# Altium project DCCBooster.PrjPCB
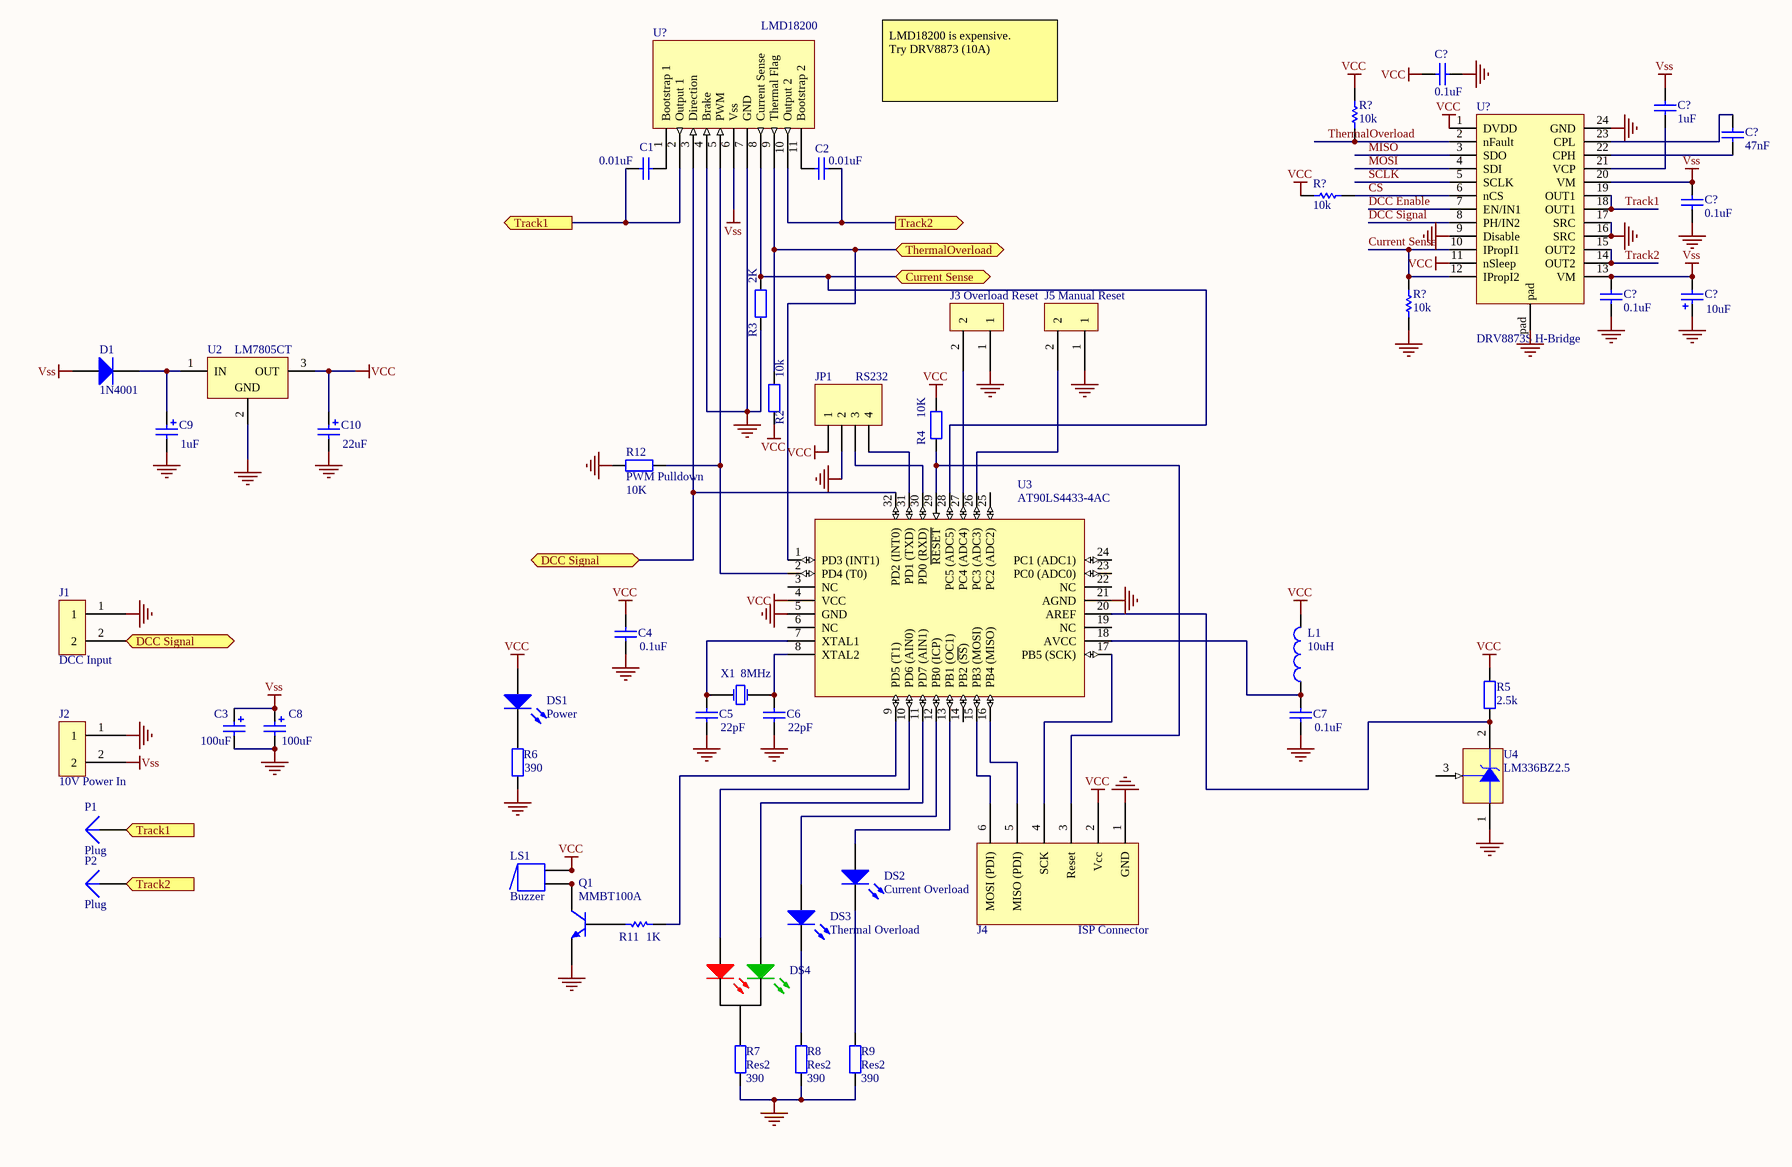
[diagram p0: DCCBooster.SchDoc]
3 sheets, 65 parts. Net scope: flat (ports and power ports of the same name join across sheets).
Board file: DCCBooster.PcbDoc
Sheets:
  DCCBooster.SchDoc
  OptoIsolator.SchDoc
  AckDetect.SchDoc

## Sheet DCCBooster.SchDoc
size A0

### Parts
(Parts that share a designator on the sheet are numbered #1, #2 ... from top to bottom, then left to right.)
*1  LMD18200  [TO220-11V]
C1  value 0.01uF  [RAD-0.1]  (hidden comment: Cap)
C2  value 0.01uF  [RAD-0.1]  (hidden comment: Cap)
C3  value 100uF  [RB5-10.5]  (hidden comment: Cap Pol1)
C4  value 0.1uF  [CC2012-0805]  (hidden comment: Cap)
C5  value 22pF  [CC2012-0805]  (hidden comment: Cap)
C6  value 22pF  [CC2012-0805]  (hidden comment: Cap)
C7  value 0.1uF  [CC2012-0805]  (hidden comment: Cap)
C8  value 100uF  [RB5-10.5]  (hidden comment: Cap Pol1)
C9  value 1uF  [CC2012-0805]  (hidden comment: Cap Pol1)
C10  value 22uF  [CC2012-0805]  (hidden comment: Cap Pol1)
C?#1  value 0.1uF  [Cap SMD 0805A]  (hidden comment: Cap)
C?#2  value 1uF  [Cap SMD 0805A]  (hidden comment: Cap)
C?#3  value 47nF  [Cap SMD 0805A]  (hidden comment: Cap)
C?#4  value 0.1uF  [Cap SMD 0805A]  (hidden comment: Cap)
C?#5  value 0.1uF  [Cap SMD 0805A]  (hidden comment: Cap)
C?#6  value 10uF  [Cap SMD Elect 5x5.3]  (hidden comment: Cap Pol)
D1  1N4001  [DIO10.46-5.3x2.8]
DS1  Power  [LED5mm]
DS2  Current Overload  [LED5mm]
DS3  Thermal Overload  [LED5mm]
DS4  (no value)  [LED5mm TriColour]
J1  DCC Input  [0.1 SIP 2 PIN]
J2  10V Power In  [0.156 SIP 2 PIN]
J3  Overload Reset  [0.1 SIP 2 PIN]
J4  ISP Connector  [0.1 SIP 6 PIN]
J5  Manual Reset  [0.1 SIP 2 PIN]
JP1  RS232  [0.1 SIP 4 PIN]
L1  value 10uH  [RAD-0.1]  (hidden comment: Inductor)
LS1  Buzzer  [Mini PC Mount Piezo]
P1  Plug  [PIN1]
P2  Plug  [PIN1]
Q1  MMBT100A  [318-08]
R2#1  value 10k  [CR2012-0805]  (hidden comment: Res2)
R3  value 2K  [CR2012-0805]  (hidden comment: Res2)
R4  value 10K  [CR2012-0805]  (hidden comment: Res2)
R5  value 2.5k  [CR2012-0805]  (hidden comment: Res2)
R6  value 390  [CR2012-0805]  (hidden comment: Res2)
R7  Res2  value 390  [CR2012-0805]
R8  Res2  value 390  [CR2012-0805]
R9  Res2  value 390  [CR2012-0805]
R11  value 1K  [R2012-0805]  (hidden comment: Res1)
R12  PWM Pulldown  value 10K  [CR2012-0805]
R?#1  value 10k  [Res SMD 0805A]  (hidden comment: Res1)
R?#2  value 10k  [Res SMD 0805A]  (hidden comment: Res1)
R?#3  value 10k  [Res SMD 0805A]  (hidden comment: Res1)
U2  LM7805CT  [T03B]
U3  AT90LS4433-4AC  [32A]
U4  LM336BZ2.5  [Z03A]
U?  DRV8873S H-Bridge  [TSSOP24 PowerPAD]
X1  8MHz  [RAD-0.2]

### Ports
Current Sense (bidir), DCC Signal (bidir), ThermalOverload (bidir), Track1 (out), Track2 (out)

### Nets
GND: *1.4(Brake) *1.7(GND) C3.2 C4.1 C5.1 C6.1 C7.1 C8.2 C9.2 C10.2 C?#1.1 C?#4.1 C?#5.1 C?#6.1 J1.1 J2.1 J3.1 J4.1(GND) J5.1 JP1.2 Q1.2(E) R3.1 R6.1 R7.1 R8.1 R9.1 R12.1 R?#3.1 U2.2(GND) U3.5(GND) U3.21(AGND) U4.1(-V) U?.9(Disable) U?.16(SRC) U?.17(SRC) U?.24(GND) U?.pad
VCC: C4.2 C10.1 C?#1.2 DS1.1(A) J4.2(Vcc) JP1.1 L1.2 LS1.1 LS1.1A R2#1.1 R4.1 R5.2 R?#1.2 R?#2.2 U2.3(OUT) U3.4(VCC) U?.1(DVDD) U?.11(nSleep)
Vss: *1.6(Vss) C3.1 C8.1 C?#2.2 C?#4.2 C?#5.2 C?#6.2 D1.1(A) J2.2 U?.13(VM) U?.20(VM)
CS: R?#2.1 U?.6(nCS)
Current Sense: R?#3.2 U?.10(IPropI1) U?.12(IPropI2)
DCC Enable: U?.7(EN/IN1)
DCC Signal: U?.8(PH/IN2)
MISO: U?.3(SDO)
MOSI: U?.4(SDI)
SCLK: U?.5(SCLK)
ThermalOverload: R?#1.1 U?.2(nFault)
Track1: U?.18(OUT1) U?.19(OUT1)
Track2: U?.14(OUT2) U?.15(OUT2)
Net*1_1: *1.1(Bootstrap_1) C1.1
Net*1_2: *1.2(Output_1) C1.2 P1.1 ; port Track1
Net*1_3: *1.3(Direction) J1.2 U3.32(PD2_(INT0)) ; port DCC Signal
Net*1_5: *1.5(PWM) R12.2 U3.2(PD4_(T0))
Net*1_8: *1.8(Current_Sense) R3.2 U3.28(PC5_(ADC5)) ; port Current Sense
Net*1_9: *1.9(Thermal_Flag) R2#1.2 U3.1(PD3_(INT1)) ; port ThermalOverload
Net*1_10: *1.10(Output_2) C2.1 P2.1 ; port Track2
Net*1_11: *1.11(Bootstrap_2) C2.2
NetC5_2: C5.2 U3.7(XTAL1) X1.1(OSC1)
NetC6_2: C6.2 U3.8(XTAL2) X1.2(OSC2)
NetC7_2: C7.2 L1.1 U3.18(AVCC)
NetC9_1: C9.1 D1.2(K) U2.1(IN)
NetC?#2_1: C?#2.1 U?.21(VCP)
NetC?#3_1: C?#3.1 U?.22(CPH)
NetC?#3_2: C?#3.2 U?.23(CPL)
NetDS1_2: DS1.2(K) R6.2
NetDS2_1: DS2.1(A) U3.13(PB1_(OC1))
NetDS2_2: DS2.2(K) R9.2
NetDS3_1: DS3.1(A) U3.12(PB0_(ICP))
NetDS3_2: DS3.2(K) R8.2
NetDS4_1: DS4.1(Ag) U3.11(PD7_(AIN1))
NetDS4_2: DS4.2(K) R7.2
NetDS4_3: DS4.3(Ar) U3.10(PD6_(AIN0))
NetJ3_2: J3.2 U3.27(PC4_(ADC4))
NetJ4_3: J4.3(Reset) R4.2 U3.29(~{RESET})
NetJ4_4: J4.4(SCK) U3.17(PB5_(SCK))
NetJ4_5: J4.5(MISO_(PDI)) U3.16(PB4_(MISO))
NetJ4_6: J4.6(MOSI_(PDI)) U3.15(PB3_(MOSI))
NetJ5_2: J5.2 U3.26(PC3_(ADC3))
NetJP1_3: JP1.3 U3.30(PD0_(RXD))
NetJP1_4: JP1.4 U3.31(PD1_(TXD))
NetLS1_2: LS1.2 LS1.2A Q1.3(C)
NetQ1_1: Q1.1(B) R11.2
NetR5_1: R5.1 U3.20(AREF) U4.2(+V)
NetR11_1: R11.1 U3.9(PD5_(T1))

Not connected (* = marked no-connect by the designer): U3 3(NC) 6(NC) 14(PB2_(~{SS})) 19(NC) 22(NC) 23(PC0_(ADC0)) 24(PC1_(ADC1)) 25(PC2_(ADC2)); U4 3(ADJ)

### Notes on the sheet
- LMD18200 is expensive.
  Try DRV8873 (10A)

### Library data of the parts
C1 C2 C4-C7 C?#1-C?#5 = Cap: Capacitor; Published: 8-Jun-2000; Publisher: Altium Limited
  C1 C2 C4-C7: Revision: July-2002: Re-released for DXP Platform.
  C?#1-C?#5: LatestRevisionDate: 17-Jul-2002; LatestRevisionNote: Re-released for DXP Platform.; PackageReference: RAD-0.3; PackageDescription: Radial Cap, Thru-Hole; 2 Leads; 0.3 in Pin Spacing
C3 C8-C10 = Cap Pol1: Polarized Capacitor (Radial); Published: 8-Jun-2000; Revision: July-2002: Re-released for DXP Platform.; Publisher: Altium Limited
C?#6 = Cap Pol: Polarized Capacitor (Radial); Published: 8-Jun-2000; LatestRevisionDate: 17-Jul-2002; LatestRevisionNote: Re-released for DXP Platform.; PackageReference: RB7.6-15; Publisher: Altium Limited; PackageDescription: Polarized Capacitor (Radial); 2 Leads
D1 = Diode 1N4001: 1 Amp General Purpose Rectifier; Revision 1: 11-Jul-2000: SIM Model Added.; Revision 2: 17-Jul-2002: Re-released for DXP Platform.; Package Information: Latest Revision: Aug-1999; Code - JEDEC: DO-204-AL; Published: 8-Jun-2000; Datasheet: Latest Revision: 1998; Package Reference: DO-41; Publisher: Altium Limited
DS1-DS3 = LED0: Typical INFRARED GaAs LED; Published: 8-Jun-2000; Revision: July-2002: Re-released for DXP Platform.; Publisher: Altium Limited
DS4 = LED Tricolour: Typical Red Green Tri Color LED; Published: 8-Jun-2000; Revision: July-2002: Re-released for DXP Platform.; Publisher: Altium Limited
J1-J3 J5 = SIP2 CONNECTOR
JP1 = Header 4: Header, 4-Pin; Revision: 17-Jul-2002: Re-released for DXP Platform.; Publisher: Altium Limited
LS1 = Buzzer: Magnetic Transducer Buzzer; Revision 1: Jul-2002: Re-released for DXP Platform.; Revision 2: 17-Dec-2003: Schematic revised, PCB Footprint replaced.; Published: 17-Dec-2003; Datasheet: Latest Revision: 17-Dec-2003; Publisher: Altium Limited
Q1 = MMBT100A: General Purpose Amplifier NPN Silicon; Package Information: Latest Revision: 1997; Published: 29-Sep-2000; Revision: 17-Jul-2002: Re-released for DXP Platform.; Datasheet: Latest Revision: 1996; Package Reference: 318-08; Publisher: Altium Limited
R2#1 R3-R9 R12 = Res2: Resistor; Published: 8-Jun-2000; Revision: July-2002: Re-released for DXP Platform.; Publisher: Altium Limited
R11 = Res1: Resistor; Published: 8-Jun-2000; Revision: July-2002: Re-released for DXP Platform.; Publisher: Altium Limited
R?#1-R?#3 = Resistor
U2 = LM7805CT: Series 3-Terminal Positive Regulator; Package Information: Latest Revision: 1995; Note: Tab is connected to GND; Published: 15-Apr-2002; Datasheet: Latest Revision: May-1999; Package Reference: T03B; Publisher: Altium Limited
U3 = AT90LS4433-4AC: 8-Bit AVR Microcontroller with 4K Bytes of In-System Programmable Flash Memory; Package Information: Latest Revision: revB, Oct-2001; Code - JEDEC: MS-026-ABA; Published: 17-Sep-2003; Datasheet: Latest Revision: 1042G-AVR-09/02; Package Reference: 32A; Publisher: Altium Limited
U4 = LM336BZ2.5: Reference Diode; Package Information: Latest Revision: 2000; Published: 15-Apr-2002; Datasheet: Latest Revision: May-1998; Package Reference: Z03A; Publisher: Altium Limited
U? = DRV8873S
X1 = XTAL: Crystal Oscillator; Published: 8-Jun-2000; Revision: July-2002: Re-released for DXP Platform.; Publisher: Altium Limited
L1 = Inductor: Published: 8-Jun-2000; Revision: July-2002: Re-released for DXP Platform.; Publisher: Altium Limited
P1 P2 = Plug: Revision: 17-Jul-2002: Re-released for DXP Platform.; Publisher: Altium Limited

## Sheet OptoIsolator.SchDoc
size A4
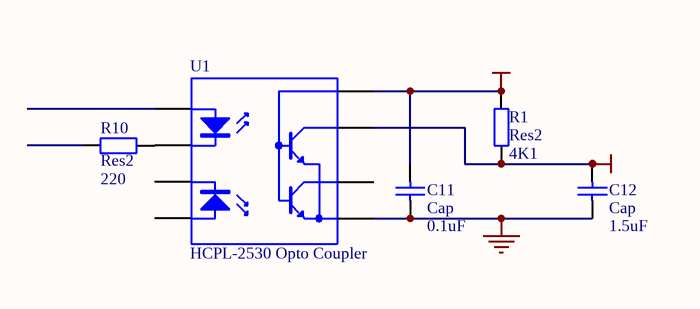
[diagram p1: OptoIsolator.SchDoc]

### Parts
(Parts that share a designator on the sheet are numbered #1, #2 ... from top to bottom, then left to right.)
C11  Cap  value 0.1uF  [RAD-0.3]
C12  Cap  value 1.5uF  [RAD-0.3]
R1#1  Res2  value 4K1  [AXIAL-0.4]
R10  Res2  value 220  [AXIAL-0.4]
U1  HCPL-2530 Opto Coupler  [8P3]

### Nets
GND: C11.1 C12.1 U1.5(E)
VCC: C11.2 R1#1.2 U1.8(E)
Vout: C12.2 R1#1.1 U1.7(C)
NetR10_2: R10.2 U1.2(K)

Not connected (* = marked no-connect by the designer): R10 1; U1 1(A) 3(K) 4(A) 6(C)

### Library data of the parts
C11 C12 = Cap: Capacitor; Published: 8-Jun-2000; Revision: July-2002: Re-released for DXP Platform.; Publisher: Altium Limited
R1#1 R10 = Res2: Resistor; Published: 8-Jun-2000; Revision: July-2002: Re-released for DXP Platform.; Publisher: Altium Limited
U1 = HCPL-2530

## Sheet AckDetect.SchDoc
size A4
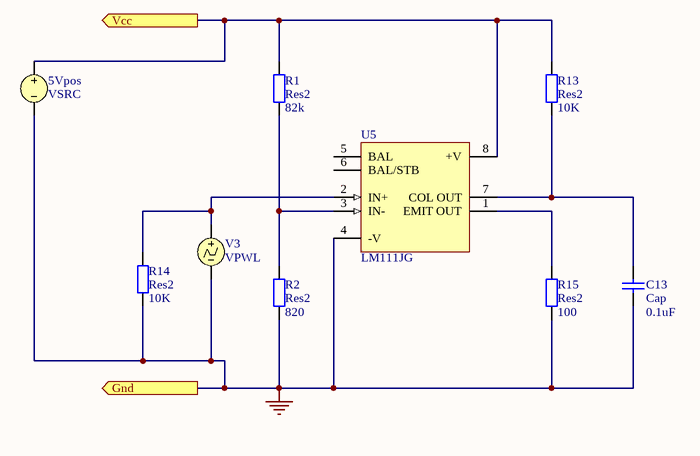
[diagram p2: AckDetect.SchDoc]

### Parts
(Parts that share a designator on the sheet are numbered #1, #2 ... from top to bottom, then left to right.)
5Vpos  VSRC
C13  Cap  value 0.1uF  [RAD-0.3]
R1#2  Res2  value 82k  [AXIAL-0.4]
R2#2  Res2  value 820  [AXIAL-0.4]
R13  Res2  value 10K  [AXIAL-0.4]
R14  Res2  value 10K  [AXIAL-0.4]
R15  Res2  value 100  [AXIAL-0.4]
U5  LM111JG  [JG008]
V3  VPWL

### Ports
Gnd, Vcc

### Nets
GND: 5Vpos.2 C13.1 R2#2.1 R14.1 R15.1 U5.4(-V) V3.2 ; port Gnd
Net5Vpos_1: 5Vpos.1 R1#2.2 R13.2 U5.8(+V) ; port Vcc
NetC13_2: C13.2 R13.1 U5.7(COL_OUT)
NetR1#2_1: R1#2.1 R2#2.2 U5.3(IN-)
NetR14_2: R14.2 U5.2(IN+) V3.1
NetR15_2: R15.2 U5.1(EMIT_OUT)

Not connected (* = marked no-connect by the designer): U5 5(BAL) 6(BAL/STB)

### Library data of the parts
5Vpos = VSRC: Voltage Source; Manufacturer: Generic Components; Class: Simulation; Note: PCB Footprint - Not required; Published: 8/06/2000; Publisher: Altium Hobart Technology Centre; Sub-Class: Voltage Source
C13 = Cap: Capacitor; Published: 8-Jun-2000; Revision: July-2002: Re-released for DXP Platform.; Publisher: Altium Limited
R1#2 R2#2 R13-R15 = Res2: Resistor; Published: 8-Jun-2000; Revision: July-2002: Re-released for DXP Platform.; Publisher: Altium Limited
U5 = LM111JG: Differential Comparator with Strobe; Package Information: Latest Revision: Jan-1995; Published: 16-Jan-2001; Revision: 17-Jul-2002: Re-released for DXP Platform.; Datasheet: Latest Revision: Feb-1992; Package Reference: JG008; Publisher: Altium Limited
V3 = VPWL: Piecewise Linear Voltage Source; Manufacturer: Generic Components; Class: Simulation; Note: PCB Footprint - Not required; Published: 8/06/2000; Publisher: Altium Hobart Technology Centre; Sub-Class: Voltage Source

## Nets that join several sheets
GND: DCCBooster (37 pins), OptoIsolator (C11.1 C12.1 U1.5), AckDetect (7 pins)
VCC: DCCBooster (18 pins), OptoIsolator (C11.2 R1#1.2 U1.8)